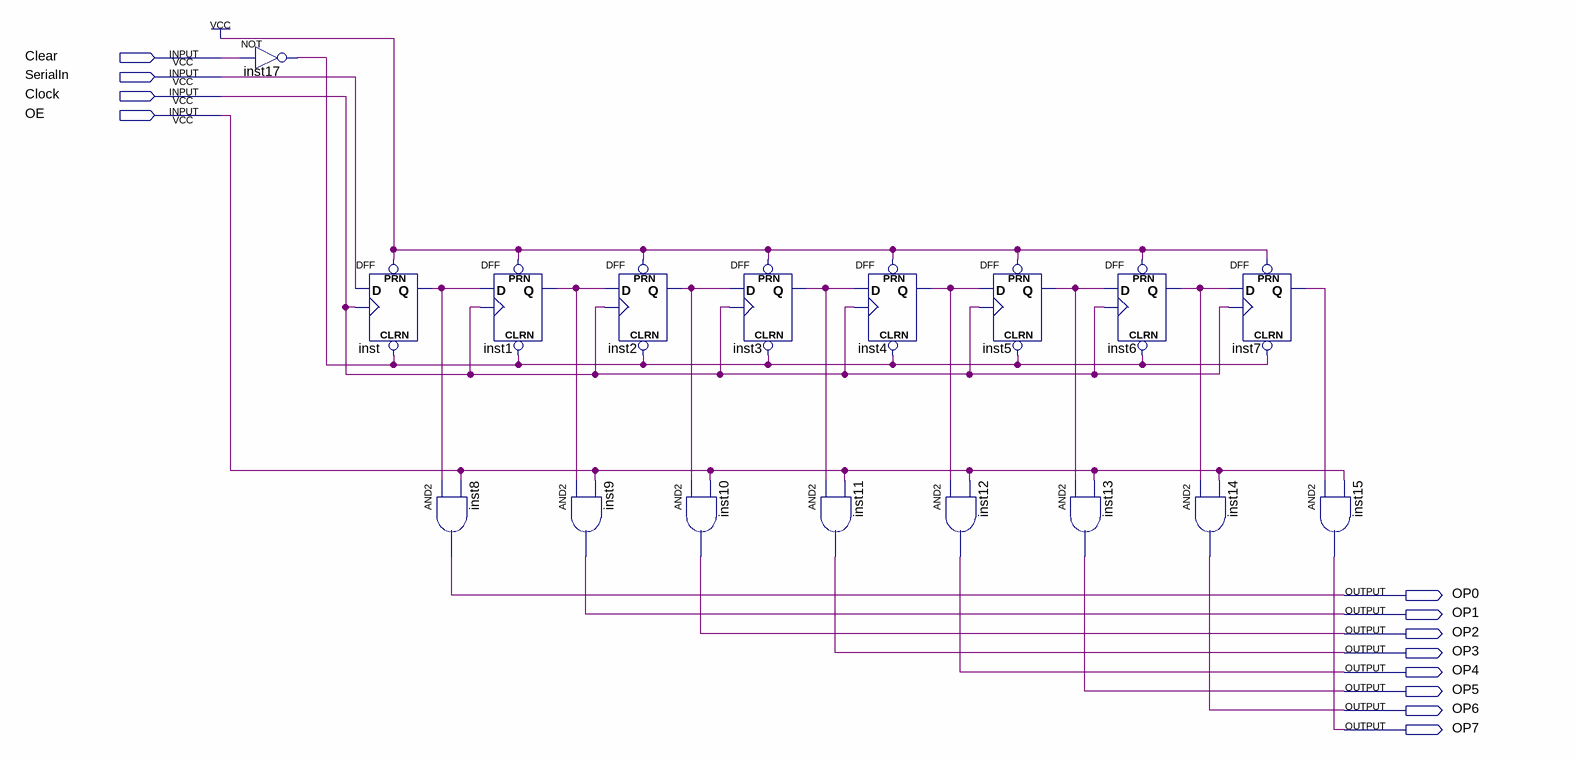
[diagram p0: schematic sheet]
// Quartus schematic SIPO8.bdf as structural Verilog: 17 symbols, 12 pins
module SIPO8 (
  input  Clear,
  input  SerialIn,
  input  Clock,
  input  OE,
  output OP0,
  output OP1,
  output OP2,
  output OP3,
  output OP4,
  output OP5,
  output OP6,
  output OP7
);

  wire inst1_q, inst2_q, inst3_q, inst4_q, inst5_q, inst6_q, inst7_q, inst17_out, inst_q;

  not inst17 (inst17_out, Clear);
  DFF inst (.CLRN(inst17_out), .CLK(Clock), .D(SerialIn), .PRN(1'b1), .Q(inst_q));
  and inst8 (OP0, inst_q, OE);
  DFF inst1 (.CLRN(inst17_out), .CLK(Clock), .D(inst_q), .PRN(1'b1), .Q(inst1_q));
  and inst9 (OP1, inst1_q, OE);
  DFF inst2 (.CLRN(inst17_out), .CLK(Clock), .D(inst1_q), .PRN(1'b1), .Q(inst2_q));
  DFF inst3 (.CLRN(inst17_out), .CLK(Clock), .D(inst2_q), .PRN(1'b1), .Q(inst3_q));
  and inst10 (OP2, inst2_q, OE);
  and inst11 (OP3, inst3_q, OE);
  DFF inst4 (.CLRN(inst17_out), .CLK(Clock), .D(inst3_q), .PRN(1'b1), .Q(inst4_q));
  and inst12 (OP4, inst4_q, OE);
  DFF inst5 (.CLRN(inst17_out), .CLK(Clock), .D(inst4_q), .PRN(1'b1), .Q(inst5_q));
  DFF inst6 (.CLRN(inst17_out), .CLK(Clock), .D(inst5_q), .PRN(1'b1), .Q(inst6_q));
  and inst13 (OP5, inst5_q, OE);
  and inst14 (OP6, inst6_q, OE);
  DFF inst7 (.CLRN(inst17_out), .CLK(Clock), .D(inst6_q), .PRN(1'b1), .Q(inst7_q));
  and inst15 (OP7, inst7_q, OE);
endmodule
